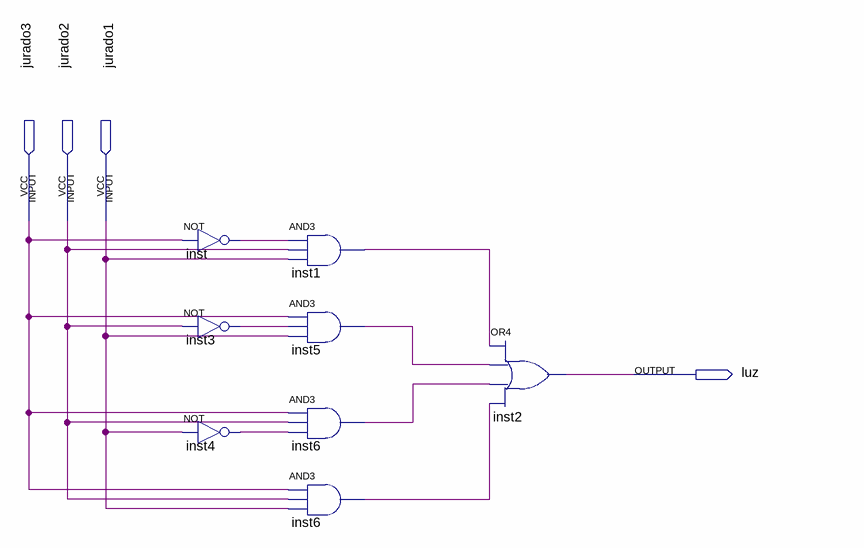
[diagram p0: schematic sheet]
// Quartus schematic sistemajurados.bdf as structural Verilog: 8 symbols, 4 pins
module sistemajurados (
  input  jurado3,
  input  jurado2,
  input  jurado1,
  output luz
);

  wire inst1_out, inst3_out, inst4_out, inst5_out, inst6_out, inst6_out_2, inst_out;

  not inst (inst_out, jurado3);
  not inst3 (inst3_out, jurado2);
  not inst4 (inst4_out, jurado1);
  and inst1 (inst1_out, inst_out, jurado2, jurado1);
  and inst5 (inst5_out, jurado3, inst3_out, jurado1);
  and inst6 (inst6_out_2, jurado3, jurado2, inst4_out);
  and inst6_dup2 (inst6_out, jurado3, jurado2, jurado1);
  or inst2 (luz, inst1_out, inst5_out, inst6_out_2, inst6_out);
endmodule
